# EasyEDA Pro project ProProject_阵列式磁场检测仪_2024-06-02.epro, board PCB2
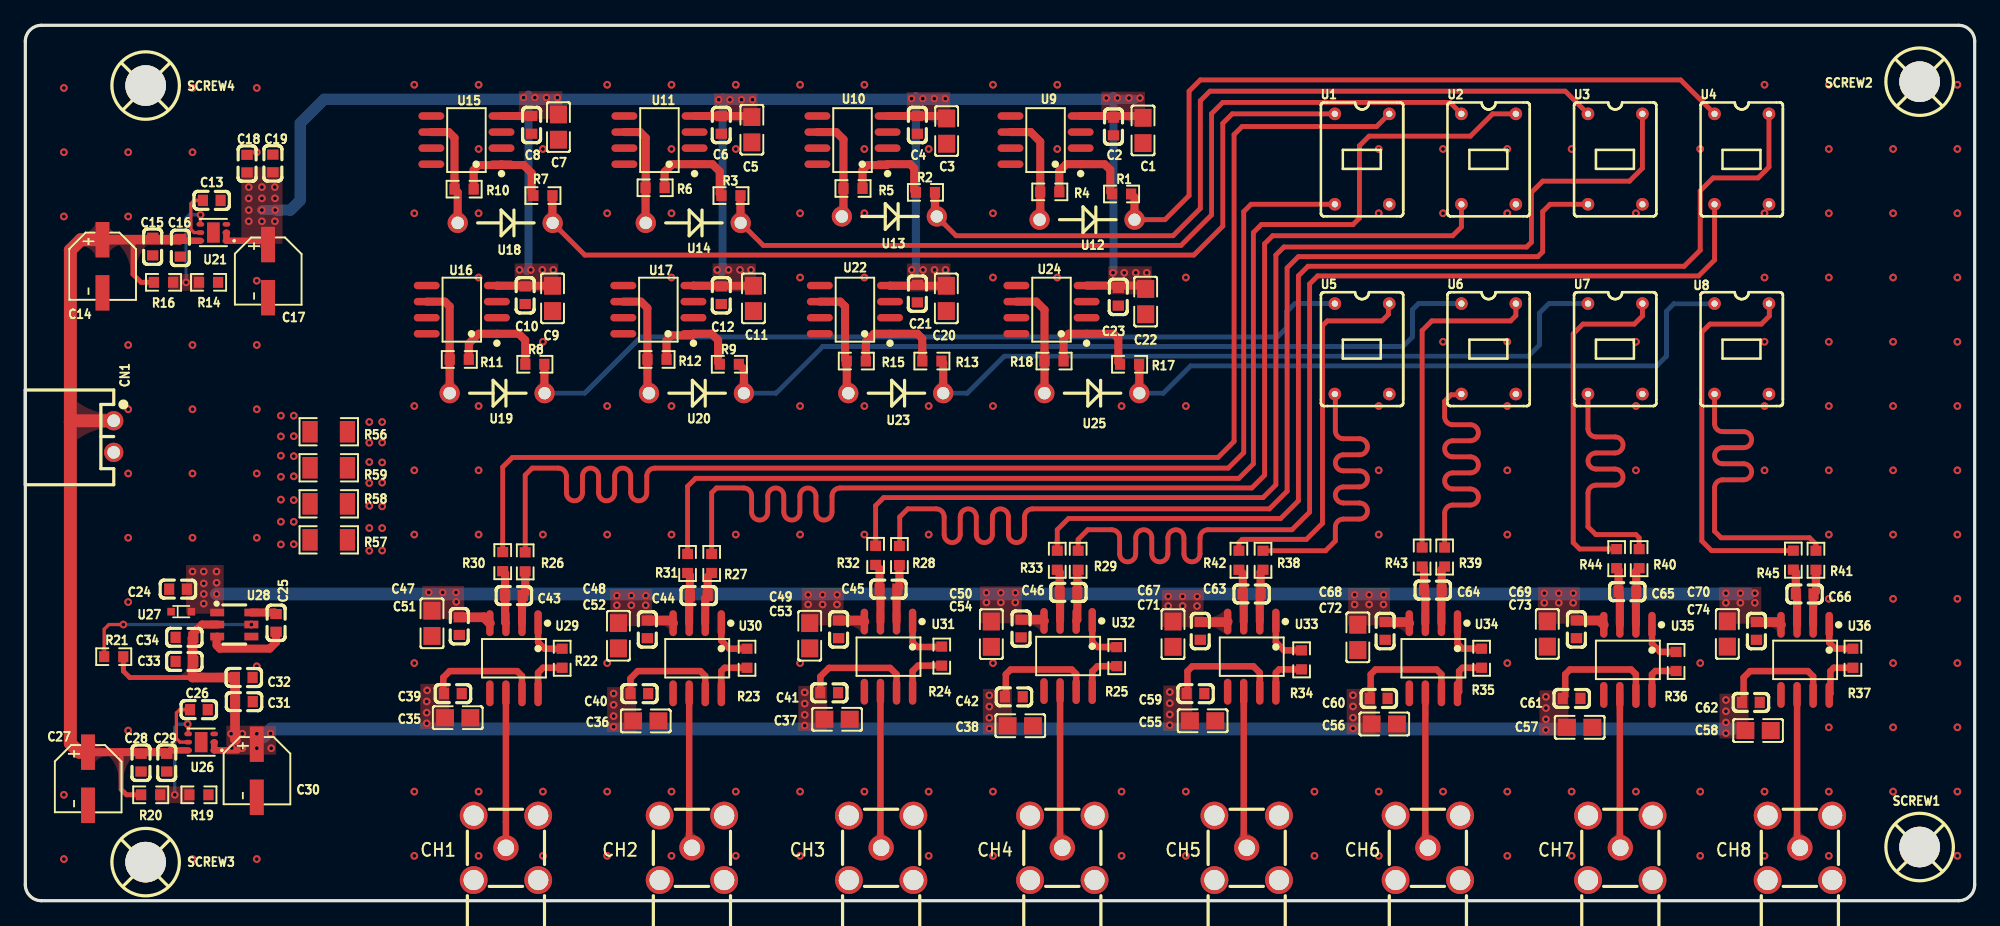
[diagram p4: board, top side]
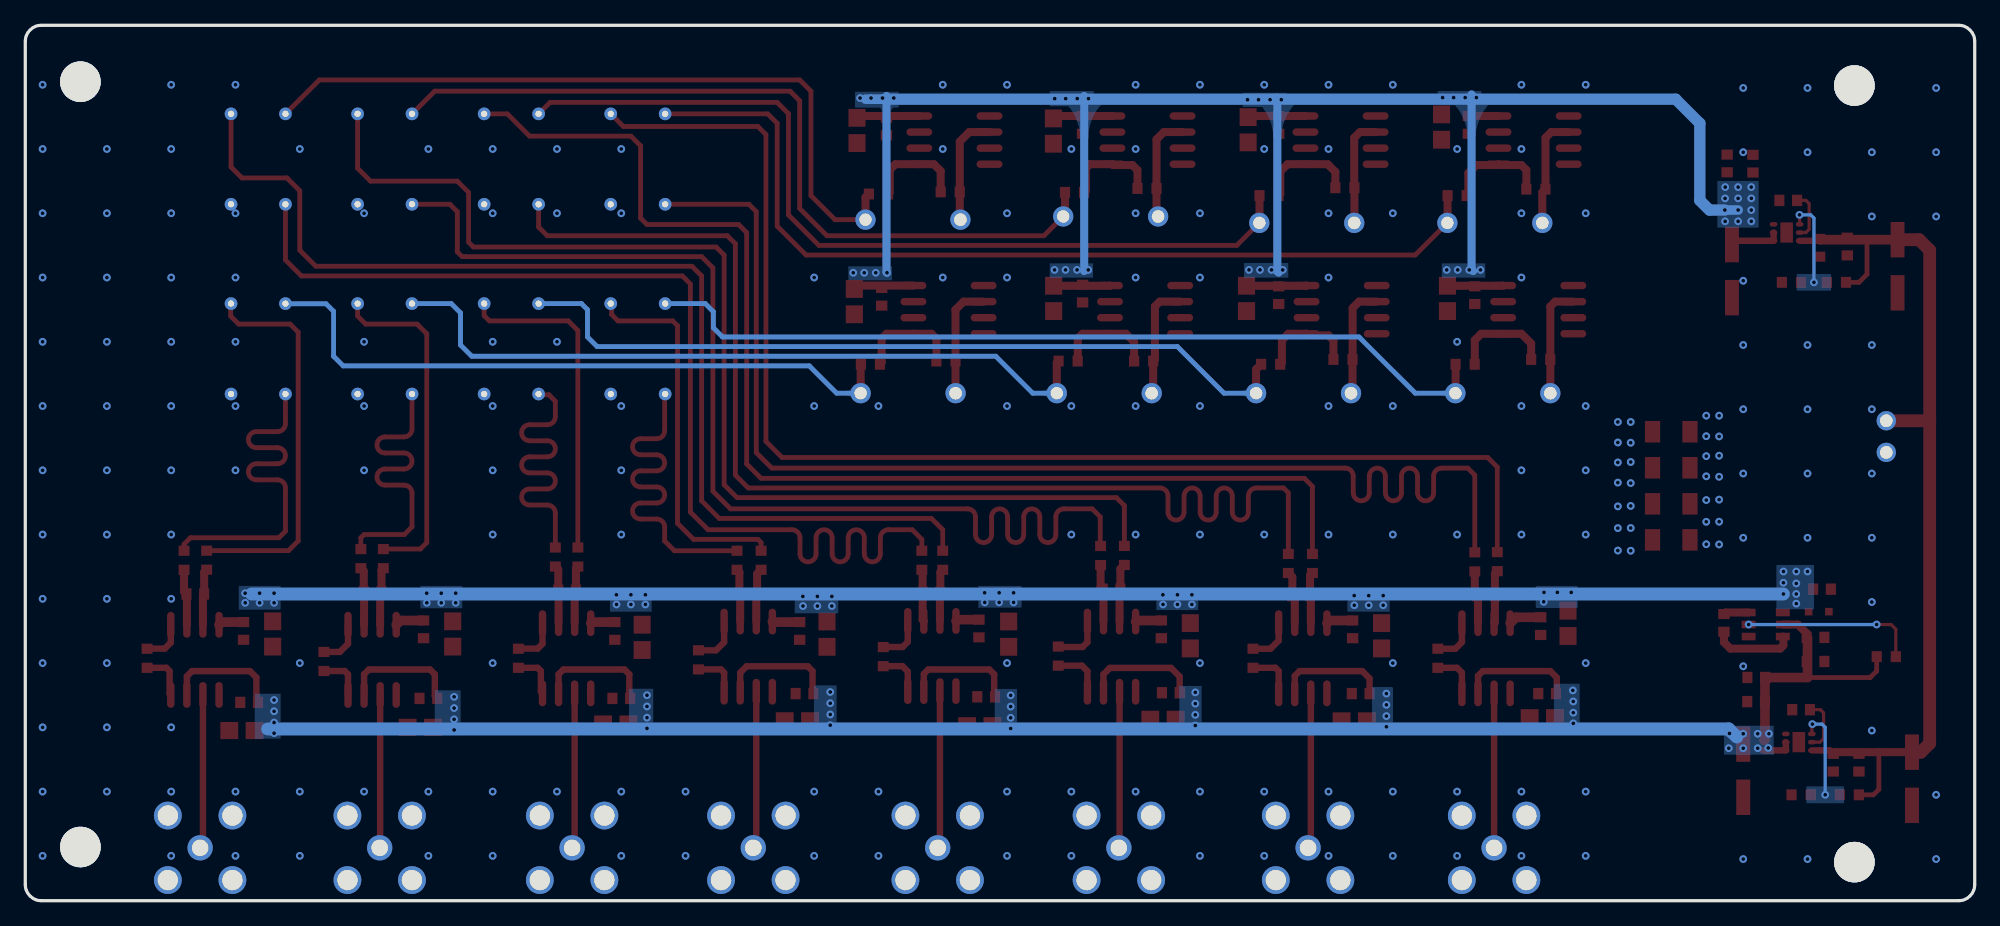
[diagram p5: board, bottom side, seen from below]

Outline 154.02 x 69.2 mm; copper layers: Top Layer, Bottom Layer. Coordinates in mm from the lower left corner of the outline.
Outline path: 0,67.93 0,1.27 arc(0.37,0.37) 1.27,0 152.75,0 arc(153.65,0.37) 154.02,1.27 154.02,67.93 arc(153.65,68.83) 152.75,69.2 1.27,69.2 arc(0.37,68.83) 0,67.93
Stack: Top Layer 0.035mm / Dielectric1 1.51mm FR4 er 4.5 / Bottom Layer 0.035mm

## Design rules (mm)
template: 自定义配置
spacing copperThickness1oz (default): track to track 0.102, other pairs 0.152 to 0.3
spacing copperThickness2oz: track to track 0.203, other pairs 0.152 to 0.3
track width copperThickness1oz (default): min 0.127, default 0.254, max 2.54
track width copperThickness2oz: min 0.203, default 0.254, max 2.54
differential pair differentialPair (default): width min 0.127, default 0.254, max 2.54; gap min 0.152, default 0.152
via viaSize (default): diameter min 0.5, default 0.61, max 10; hole min 0.3, default 0.305, max 6.3

## Placement (name value [footprint] x y rotation side)
C1  10uF  [C0805]  88.31 60.89 90 top
C2  100nF  [C0603]  85.98 61.2 90 top
C3  10uF  [C0805]  72.79 60.84 90 top
C4  100nF  [C0603]  70.48 61.33 90 top
C5  10uF  [C0805]  57.4 60.95 90 top
C6  100nF  [C0603]  54.99 61.33 90 top
C7  10uF  [C0805]  42.12 61.16 90 top
C8  100nF  [C0603]  40 61.33 90 top
C9  10uF  [C0805]  41.66 47.61 90 top
C10  100nF  [C0603]  39.5 47.87 90 top
C11  10uF  [C0805]  57.53 47.61 90 top
C12  100nF  [C0603]  54.99 47.87 90 top
C13  1nF  [C0603]  14.73 55.36 0 top
C14  10uF  [CAP-SMD_BD5.0-L5.3-W5.3-FD]  6.1 50.15 270 top
C15  2.2uF  [C0603]  10.06 51.71 90 top
C16  100nF  [C0603]  12.25 51.62 90 top
C17  10uF  [CAP-SMD_BD5.0-L5.3-W5.3-FD]  19.18 49.77 270 top
C18  2.2uF  [C0603]  17.52 58.27 270 top
C19  100nF  [C0603]  19.56 58.28 270 top
C20  10uF  [C0805]  72.77 47.61 90 top
C21  100nF  [C0603]  70.48 48 90 top
C22  10uF  [C0805]  88.52 47.36 90 top
C23  100nF  [C0603]  86.36 47.74 90 top
C24  3.3uF  [C0603]  12.06 24.63 0 top
C25  3.3uF  [C0603]  19.81 21.96 270 top
C26  1nF  [C0603]  13.72 15.1 0 top
C27  10uF  [CAP-SMD_BD5.0-L5.3-W5.3-FD]  4.95 9.64 270 top
C28  2.2uF  [C0603]  9.14 10.91 90 top
C29  100nF  [C0603]  11.18 10.91 90 top
C30  10uF  [CAP-SMD_BD5.0-L5.3-W5.3-FD]  18.29 10.28 270 top
C31  2.2uF  [C0603]  17.27 15.74 180 top
C32  100nF  [C0603]  17.26 17.65 180 top
C33  3.3uF  [C0603]  12.57 18.91 0 top
C34  100nF  [C0603]  12.57 20.82 0 top
C35  10uF  [C0805]  34.16 14.47 180 top
C36  10uF  [C0805]  49.02 14.21 180 top
C37  10uF  [C0805]  64.14 14.34 180 top
C38  10uF  [C0805]  78.61 13.83 180 top
C39  100nF  [C0603]  33.78 16.37 180 top
C40  100nF  [C0603]  48.51 16.37 180 top
C41  100nF  [C0603]  63.52 16.44 180 top
C42  100nF  [C0603]  78.11 16.12 180 top
C43  47nF  [C0603]  38.61 24.12 0 top
C44  47nF  [C0603]  53.21 24.12 0 top
C45  47nF  [C0603]  68.2 24.63 0 top
C46  47nF  [C0603]  82.42 24.37 0 top
C47  10uF  [C0805]  32.13 21.93 90 top
C48  10uF  [C0805]  46.86 20.94 90 top
C49  10uF  [C0805]  61.98 20.94 90 top
C50  10uF  [C0805]  76.33 21.07 90 top
C51  100nF  [C0603]  34.29 21.71 90 top
C52  100nF  [C0603]  49.15 21.45 90 top
C53  100nF  [C0603]  64.26 21.45 90 top
C54  100nF  [C0603]  78.67 21.52 90 top
C55  10uF  [C0805]  93.02 14.22 180 top
C56  10uF  [C0805]  107.37 13.97 180 top
C57  10uF  [C0805]  122.81 13.71 180 top
C58  10uF  [C0805]  136.91 13.45 180 top
C59  100nF  [C0603]  92.46 16.37 180 top
C60  100nF  [C0603]  106.93 15.99 180 top
C61  100nF  [C0603]  122.17 15.99 180 top
C62  100nF  [C0603]  136.34 15.68 180 top
C63  47nF  [C0603]  96.9 24.25 0 top
C64  47nF  [C0603]  111.21 24.55 0 top
C65  47nF  [C0603]  126.58 24.42 0 top
C66  47nF  [C0603]  140.59 24.25 0 top
C67  10uF  [C0805]  90.68 21.07 90 top
C68  10uF  [C0805]  105.28 20.82 90 top
C69  10uF  [C0805]  120.25 21.09 90 top
C70  10uF  [C0805]  134.48 21.09 90 top
C71  100nF  [C0603]  92.84 21.33 90 top
C72  100nF  [C0603]  107.44 21.33 90 top
C73  100nF  [C0603]  122.55 21.45 90 top
C74  100nF  [C0603]  136.78 21.33 90 top
CH1  BWSMA-KWE-Z001  [SMA-TH_BWSMA-KWE-Z001]  37.97 4.18 270 top
CH2  BWSMA-KWE-Z001  [SMA-TH_BWSMA-KWE-Z001]  52.67 4.18 270 top
CH3  BWSMA-KWE-Z001  [SMA-TH_BWSMA-KWE-Z001]  67.62 4.18 270 top
CH4  BWSMA-KWE-Z001  [SMA-TH_BWSMA-KWE-Z001]  81.93 4.18 270 top
CH5  BWSMA-KWE-Z001  [SMA-TH_BWSMA-KWE-Z001]  96.5 4.18 270 top
CH6  BWSMA-KWE-Z001  [SMA-TH_BWSMA-KWE-Z001]  110.82 4.18 270 top
CH7  BWSMA-KWE-Z001  [SMA-TH_BWSMA-KWE-Z001]  126.02 4.18 270 top
CH8  BWSMA-KWE-Z001  [SMA-TH_BWSMA-KWE-Z001]  140.21 4.18 270 top
CN1  XH2.54-2P_H弯针插座  [CONN-TH_2P-P2.5_XH2.54-2P_H]  6.98 36.69 270 top
R1  1.4kΩ  [R0603]  86.61 55.87 0 top
R2  1.4kΩ  [R0603]  71.12 56 0 top
R3  1.4kΩ  [R0603]  55.75 55.74 0 top
R4  140Ω  [R0603]  80.94 56.03 180 top
R5  140Ω  [R0603]  65.4 56.3 180 top
R6  140Ω  [R0603]  49.76 56.36 180 top
R7  1.4kΩ  [R0603]  40.89 55.74 0 top
R8  1.4kΩ  [R0603]  40.26 42.41 0 top
R9  1.4kΩ  [R0603]  55.63 42.41 0 top
R10  140Ω  [R0603]  34.67 56.25 180 top
R11  140Ω  [R0603]  34.29 42.79 180 top
R12  140Ω  [R0603]  49.91 42.79 180 top
R13  1.4kΩ  [R0603]  71.63 42.66 0 top
R14  24kΩ  [R0603]  14.48 48.88 0 top
R15  140Ω  [R0603]  65.66 42.66 180 top
R16  150kΩ  [R0603]  10.92 48.88 0 top
R17  1.4kΩ  [R0603]  87.25 42.41 0 top
R18  140Ω  [R0603]  81.28 42.66 180 top
R19  24kΩ  [R0603]  13.72 8.37 0 top
R20  150kΩ  [R0603]  9.91 8.37 0 top
R21  10K  [R0603]  6.98 19.29 0 top
R22  499Ω  [R0603]  42.42 19.17 90 top
R23  499Ω  [R0603]  57.02 19.17 90 top
R24  499Ω  [R0603]  72.41 19.33 90 top
R25  499Ω  [R0603]  86.23 19.29 90 top
R26  1kΩ  [R0603]  39.5 26.79 90 top
R27  1kΩ  [R0603]  54.23 26.66 90 top
R28  1kΩ  [R0603]  69.06 27.29 90 top
R29  1kΩ  [R0603]  83.18 26.91 90 top
R30  1kΩ  [R0603]  37.72 26.8 90 top
R31  1kΩ  [R0603]  52.32 26.66 90 top
R32  1kΩ  [R0603]  67.18 27.29 90 top
R33  1kΩ  [R0603]  81.53 26.91 90 top
R34  499Ω  [R0603]  100.84 19.04 90 top
R35  499Ω  [R0603]  115.06 19.17 90 top
R36  499Ω  [R0603]  130.43 18.91 90 top
R37  499Ω  [R0603]  144.4 19.17 90 top
R38  1kΩ  [R0603]  97.79 26.91 90 top
R39  1kΩ  [R0603]  112.14 27.17 90 top
R40  1kΩ  [R0603]  127.51 27.04 90 top
R41  1kΩ  [R0603]  141.48 26.91 90 top
R42  1kΩ  [R0603]  95.89 26.91 90 top
R43  1kΩ  [R0603]  110.36 27.17 90 top
R44  1kΩ  [R0603]  125.73 27.04 90 top
R45  1kΩ  [R0603]  139.69 26.92 90 top
R56  0Ω  [R1206]  23.97 37.07 0 top
R57  0Ω  [R1206]  23.97 28.53 0 top
R58  0Ω  [R1206]  23.97 31.38 0 top
R59  0Ω  [R1206]  23.97 34.22 0 top
SCREW1  -  [M3螺丝]  149.73 4.18 0 top
SCREW2  -  [M3螺丝]  149.73 64.68 0 top
SCREW3  -  [M3螺丝]  9.57 2.99 0 top
SCREW4  -  [M3螺丝]  9.57 64.38 0 top
U1  -  [HALL]  102.36 63.11 0 top
U2  -  [HALL]  112.36 63.11 0 top
U3  -  [HALL]  122.36 63.11 0 top
U4  -  [HALL]  132.36 63.11 0 top
U5  -  [HALL]  102.36 48.11 0 top
U6  -  [HALL]  112.36 48.11 0 top
U7  -  [HALL]  122.36 48.11 0 top
U8  -  [HALL]  132.36 48.11 0 top
U9  LM234DT  [SOIC-8_L4.9-W3.9-P1.27-LS6.0-BL]  80.61 60.13 90 top
U10  LM234DT  [SOIC-8_L4.9-W3.9-P1.27-LS6.0-BL]  65.36 60.13 90 top
U11  LM234DT  [SOIC-8_L4.9-W3.9-P1.27-LS6.0-BL]  50.11 60.13 90 top
U12  -  [IN457]  80.14 53.84 0 top
U13  -  [IN457]  64.52 54.09 0 top
U14  -  [IN457]  49.02 53.58 0 top
U15  LM234DT  [SOIC-8_L4.9-W3.9-P1.27-LS6.0-BL]  34.85 60.13 90 top
U16  LM234DT  [SOIC-8_L4.9-W3.9-P1.27-LS6.0-BL]  34.49 46.72 90 top
U17  LM234DT  [SOIC-8_L4.9-W3.9-P1.27-LS6.0-BL]  50.02 46.72 90 top
U18  -  [IN457]  34.16 53.58 0 top
U19  -  [IN457]  33.53 40.12 0 top
U20  -  [IN457]  49.28 40.12 0 top
U21  SGM2211-5.0XTDI6G/TR  [TDFN-6_L2.0-W2.0-P0.65-BL-EP]  14.86 52.82 90 top
U22  LM234DT  [SOIC-8_L4.9-W3.9-P1.27-LS6.0-BL]  65.55 46.72 90 top
U23  -  [IN457]  65.02 40.12 0 top
U24  LM234DT  [SOIC-8_L4.9-W3.9-P1.27-LS6.0-BL]  81.08 46.72 90 top
U25  -  [IN457]  80.52 40.12 0 top
U26  SGM2211-5.0XTDI6G/TR  [TDFN-6_L2.0-W2.0-P0.65-BL-EP]  13.89 12.53 90 top
U27  IN4148WT  [SOD-523_L1.2-W0.8-LS1.6-FD]  12.32 22.85 180 top
U28  SGM3204YN6G/TR  [SOT-23-6_L2.9-W1.6-P0.95-LS2.8-BR]  16.51 21.83 180 top
U29  INA101ASOIC8  [SOIC-8_L4.9-W3.9-P1.27-LS6.0-BL]  38.61 19.17 180 top
U30  INA101ASOIC8  [SOIC-8_L4.9-W3.9-P1.27-LS6.0-BL]  53.09 19.17 180 top
U31  INA101ASOIC8  [SOIC-8_L4.9-W3.9-P1.27-LS6.0-BL]  68.2 19.29 180 top
U32  INA101ASOIC8  [SOIC-8_L4.9-W3.9-P1.27-LS6.0-BL]  82.39 19.34 180 top
U33  INA101ASOIC8  [SOIC-8_L4.9-W3.9-P1.27-LS6.0-BL]  96.9 19.29 180 top
U34  INA101ASOIC8  [SOIC-8_L4.9-W3.9-P1.27-LS6.0-BL]  111.25 19.17 180 top
U35  INA101ASOIC8  [SOIC-8_L4.9-W3.9-P1.27-LS6.0-BL]  126.62 19.04 180 top
U36  INA101ASOIC8  [SOIC-8_L4.9-W3.9-P1.27-LS6.0-BL]  140.62 19.04 180 top

## Footprints (pads in the part's own frame, mm; a bottom-side part is the same pattern mirrored in y, then rotated)
C0603
  rect 0.8x0.9 smd: 1(-0.7,0) 2(0.7,0)
C0805
  rect 1.41x1.35 smd: 1(-1,0) 2(1,0)
CAP-SMD_BD5.0-L5.3-W5.3-FD
  rect 2.8x1.1 smd: 1(-2.1,0) 2(2.1,0)
CONN-TH_2P-P2.5_XH2.54-2P_H
  round 1.524 hole 1: 1(-1.25,0) 2(1.25,0)
HALL
  round 1 hole 0.5: 1(1.104,-0.904) 2(1.104,-8.053) 3(5.404,-8.053) 4(5.404,-0.904)
IN457
  round 1.6 hole 0.99x0.97: 1(0,0)
  round 1.6 hole 0.97: 2(7.5,0)
M3螺丝
  round 3.2 hole 3.2: 1(-0.064,0.064)
R0603
  rect 0.806x0.864 smd: 1(-0.753,0) 2(0.753,0)
R1206
  rect 1.208x1.701 smd: 1(-1.479,0) 2(1.479,0)
SMA-TH_BWSMA-KWE-Z001
  round 2.2 hole 1.6: 1(-2.55,-2.55) 2(-2.55,2.55) 3(2.55,2.55) 4(2.55,-2.55)
  round 2 hole 1.3: 5(0,0)
SOD-523_L1.2-W0.8-LS1.6-FD
  rect 0.6x0.6 smd: 1(-0.8,0) 2(0.8,0)
SOIC-8_L4.9-W3.9-P1.27-LS6.0-BL
  oval 0.588x2.045 smd: 1(-1.905,-2.772) 2(-0.635,-2.772) 3(0.635,-2.772) 4(1.905,-2.772) 5(1.905,2.772) 6(0.635,2.772) 7(-0.635,2.772) 8(-1.905,2.772)
SOT-23-6_L2.9-W1.6-P0.95-LS2.8-BR
  rect 1.1x0.6 smd: 1(1.35,-0.95) 2(1.35,0) 3(1.35,0.95) 4(-1.35,0.95) 5(-1.35,0) 6(-1.35,-0.95)
TDFN-6_L2.0-W2.0-P0.65-BL-EP
  oval 0.364x0.607 smd: 1(-0.65,-1.028) 2(0,-1.028) 3(0.65,-1.028) 4(0.65,1.028) 5(0,1.028) 6(-0.65,1.028)
  rect 1.6x1 smd: 7(0,0)

## Nets
As in the schematic.

Pads without a net: SCREW1 1; SCREW2 1; SCREW3 1; SCREW4 1; U9 2 3 5 7 8; U10 2 3 5 7 8; U11 2 3 5 7 8; U15 2 3 5 7 8; U16 2 3 5 7 8; U17 2 3 5 7 8; U22 2 3 5 7 8; U24 2 3 5 7 8

## Via types
v1: diameter 0.61, hole 0.304, Top Layer to Bottom Layer, 157 vias
v2: diameter 0.61, hole 0.305, Top Layer to Bottom Layer, 201 vias

## Routing (per net, layer and track width the routed paths; a pad name or vN(x,y) marks a point on that pad's centre or on a via; arc(x,y) is an arc through that point)
5V: length 213.5
  Top Layer w0.381: 13.21,17.64 8.25,17.64 7.75,18.15 7.75,19.28 R21.2
  Top Layer w0.508: U33.7 97.54,18.02 97.03,18.53 92.2,18.53 91.82,18.15 91.82,16.44 C59.2 ; 16.76,11.88 U26.1 U26.2 ; 47.81,16.37 47.81,17.58 48.39,18.15 53.34,18.15 53.72,17.77 U30.7 ; C61.2 121.67,16.18 121.67,17.9 122.05,18.28 126.87,18.28 127.25,17.9 U35.7 ; U36.7 141.26,17.74 140.84,18.15 136.27,18.15 135.76,17.64 135.76,15.8 C62.2 ; C42.2 77.47,16.18 77.47,17.9 77.85,18.28 82.68,18.28 83.03,17.93 U32.7 ; U29.7 39.24,17.77 38.86,18.15 33.53,18.15 33.02,17.64 33.02,16.43 C39.2 ; C60.2 106.3,16.06 106.3,17.9 106.68,18.28 111.51,18.28 111.89,17.9 U34.7 ; 62.82,16.44 62.82,17.72 63.5,18.4 68.33,18.4 68.83,17.9 U31.7
  Top Layer w0.635: C34.2 13.27,21.14 13.97,21.83 15.16,21.83
  Top Layer w0.762: 16.38,17.52 16.26,17.64 13.21,17.64 13.21,20.75 C34.2 ; 16.64,12.69 16.57,12.75 C31.2 16.57,17.63 C32.2
  Bottom Layer w1.016: 18.8,12.94 19.43,13.58 134.87,13.58
  vias: v2(16.26,13.2) v2(16.31,12.07) v2(17.14,13.2) v2(17.14,12.05) v2(18.29,13.2) v2(18.29,12.05) v2(19.38,13.22) v2(19.43,12.05) v2(31.75,16.63) v2(31.72,15.75) v2(31.72,14.86) v2(31.72,14.02) v2(46.48,16.37) v2(46.48,15.48) v2(46.48,14.59) v2(46.48,13.75) v2(61.58,16.47) v2(61.58,15.58) v2(61.58,14.69) v2(61.58,13.85) v2(76.17,16.23) v2(76.17,15.35) v2(76.17,14.46) v2(76.17,13.61) v2(90.42,16.5) v2(90.42,15.61) v2(90.42,14.72) v2(90.42,13.88) v2(104.9,16.25) v2(104.9,15.36) v2(104.9,14.47) v2(104.9,13.62) v2(120.14,16.12) v2(120.14,15.23) v2(120.14,14.34) v2(120.14,13.5) v2(134.37,15.86) v2(134.37,14.98) v2(134.37,14.09) v2(134.37,13.24)
9V: length 72
  Top Layer w0.381: 8.51,51.93 8.51,49.52 9.14,48.88 R16.1 ; R20.1 8,8.37 7.57,8.8 7.57,11.74
  Top Layer w0.508: C16.2 12.4,52.17 U21.6 ; U26.6 11.45,11.88 C29.2
  Top Layer w0.635: C29.2 11.05,11.74 C27.1
  Top Layer w0.762: C16.2 12.19,52.25 C14.1
  Top Layer w1.016: 3.56,37.84 3.66,37.94 CN1.1 ; 3.56,37.84 3.56,51.42 4.39,52.25 C14.1 ; 3.56,37.84 3.56,12.44 4.25,11.74 C27.1
-5V: length 138.1
  Top Layer w0.762: C54.2 80.39,22.22 U32.4 ; U34.4 109.26,22.03 C72.2 ; C53.2 66.21,22.15 U31.4 ; C51.2 36.24,22.41 U29.4 ; U35.4 124.37,22.15 C73.2 ; U33.4 94.96,22.03 C71.2 ; C52.2 50.97,22.15 U30.4 ; C74.2 138.5,22.03 U36.4
  Bottom Layer w1.016: v2(15.11,24.25) 136.14,24.25
  vias: v2(13.21,26.02) v2(14.1,26.02) v2(14.1,25.08) v2(14.1,24.25) v2(14.1,23.48) v2(15.11,26.02) v2(15.11,25.14) v2(31.88,24.37) v2(32.98,24.37) v2(34.03,24.37) v2(34.05,23.62) v2(46.74,24.12) v2(46.74,23.36) v2(47.88,24.12) v2(47.88,23.36) v2(49.03,24.12) v2(49.02,23.36) v2(61.85,24.18) v2(61.85,23.42) v2(62.99,24.18) v2(62.99,23.42) v2(64.14,24.18) v2(64.13,23.42) v2(75.93,24.34) v2(75.93,23.58) v2(77.08,24.34) v2(77.08,23.58) v2(78.23,24.34) v2(78.22,23.58) v2(90.3,24.06) v2(90.3,23.29) v2(91.44,24.06) v2(91.44,23.29) v2(92.59,24.06) v2(92.58,23.29) v2(105.03,24.18) v2(105.03,23.42) v2(106.17,24.18) v2(106.17,23.42) v2(107.32,24.18) v2(107.31,23.42) v2(120.02,24.31) v2(120.02,23.55) v2(121.16,24.31) v2(121.16,23.55) v2(122.31,24.31) v2(122.3,23.55) v2(134.37,24.31) v2(134.37,23.55) v2(135.51,24.31) v2(135.51,23.55) v2(136.66,24.31) v2(136.65,23.55)
AGND:
  vias: v1(30.73,64.51) v1(30.73,54.35) v1(30.73,39.11) v1(30.73,34.03) v1(30.73,28.95) v1(30.73,18.79) v1(30.73,8.63) v1(30.73,3.55) v1(35.81,64.51) v1(35.81,59.43) v1(35.81,54.35) v1(35.81,49.27) v1(35.81,39.11) v1(35.81,34.03) v1(35.81,28.95) v1(35.81,8.63) v1(35.81,3.55) v1(40.89,59.43) v1(40.89,44.19) v1(40.89,28.95) v1(40.89,8.63) v1(40.89,3.55) v1(45.97,64.51) v1(45.97,54.35) v1(45.97,39.11) v1(45.97,28.95) v1(45.97,18.79) v1(45.97,8.63) v1(45.97,3.55) v1(51.05,64.51) v1(51.05,59.43) v1(51.05,54.35) v1(51.05,49.27) v1(51.05,39.11) v1(51.05,28.95) v1(51.05,8.63) v1(51.05,3.55) v1(56.13,64.51) v1(56.13,59.43) v1(56.13,28.95) v1(56.13,8.63) v1(56.13,3.55) v1(61.21,64.51) v1(61.21,54.35) v1(61.21,49.27) v1(61.21,39.11) v1(61.21,28.95) v1(61.21,18.79) v1(61.21,8.63) v1(61.21,3.55) v1(66.29,64.51) v1(66.29,59.43) v1(66.29,54.35) v1(66.29,49.27) v1(66.29,39.11) v1(66.29,28.95) v1(66.29,8.63) v1(71.37,59.43) v1(71.37,39.11) v1(71.37,28.95) v1(71.37,8.63) v1(71.37,3.55) v1(76.45,64.51) v1(76.45,54.35) v1(76.45,49.27) v1(76.45,39.11) v1(76.45,18.79) v1(76.45,8.63) v1(76.45,3.55) v1(81.53,64.51) v1(81.53,59.43) v1(81.53,49.27) v1(86.61,39.11) v1(86.61,8.63) v1(86.61,3.55) v1(91.69,49.27) v1(91.69,39.11) v1(91.69,8.63) v1(91.69,3.55) v1(101.85,8.63) v1(101.85,3.55) v1(106.93,59.43) v1(106.93,54.35) v1(106.93,39.11) v1(106.93,34.03) v1(106.93,28.95) v1(106.93,8.63) v1(106.93,3.55) v1(112.01,59.43) v1(112.01,54.35) v1(112.01,44.19) v1(112.01,8.63) v1(117.09,59.43) v1(117.09,54.35) v1(117.09,44.19) v1(117.09,39.11) v1(117.09,34.03) v1(117.09,28.95) v1(117.09,18.79) v1(117.09,8.63) v1(117.09,3.55) v1(122.17,59.43) v1(122.17,8.63) v1(122.17,3.55) v1(127.25,54.35) v1(127.25,44.19) v1(127.25,39.11) v1(127.25,34.03) v1(127.25,8.63) v1(132.33,59.43) v1(132.33,18.79) v1(132.33,8.63) v1(132.33,3.55) v1(137.41,64.51) v1(137.41,54.35) v1(137.41,49.27) v1(137.41,44.19) v1(137.41,39.11) v1(137.41,34.03) v1(137.41,8.63) v1(137.41,3.55) v1(142.49,64.51) v1(142.49,59.43) v1(142.49,54.35) v1(142.49,49.27) v1(142.49,44.19) v1(142.49,39.11) v1(142.49,34.03) v1(142.49,28.95) v1(142.49,23.87) v1(142.49,13.71) v1(142.49,8.63) v1(142.49,3.55) v1(147.57,59.43) v1(147.57,54.35) v1(147.57,49.27) v1(147.57,44.19) v1(147.57,39.11) v1(147.57,34.03) v1(147.57,28.95) v1(147.57,23.87) v1(147.57,18.79) v1(147.57,13.71) v1(147.57,8.63) v1(152.65,64.51) v1(152.65,59.43) v1(152.65,54.35) v1(152.65,49.27) v1(152.65,44.19) v1(152.65,39.11) v1(152.65,34.03) v1(152.65,28.95) v1(152.65,23.87) v1(152.65,18.79) v1(152.65,13.71) v1(152.65,8.63) v1(152.65,3.55) v2(27.18,37.85) v2(27.18,36.21) v2(27.18,34.68) v2(27.18,33.02) v2(27.18,31.21) v2(27.18,29.46) v2(27.18,27.67) v2(28.19,37.85) v2(28.19,36.22) v2(28.19,34.65) v2(28.19,33.05) v2(28.19,31.17) v2(28.19,29.45) v2(28.19,27.68)
PGND:
  vias: v2(3.05,64.25) v2(3.05,59.17) v2(3.05,54.09) v2(3.05,8.37) v2(3.05,3.29) v2(8.13,59.17) v2(8.13,54.09) v2(8.13,43.93) v2(8.13,38.85) v2(8.13,33.77) v2(8.13,28.69) v2(8.13,23.61) v2(8.13,13.45) v2(13.21,64.25) v2(13.21,59.17) v2(13.21,43.93) v2(13.21,38.85) v2(13.21,33.77) v2(13.21,28.69) v2(13.21,3.29) v2(18.29,64.25) v2(18.29,59.17) v2(18.29,49.01) v2(18.29,43.93) v2(18.29,38.85) v2(18.29,33.77) v2(18.29,28.69) v2(18.29,18.53) v2(18.29,3.29) v2(20.19,38.34) v2(20.19,36.7) v2(20.19,35.18) v2(20.19,33.51) v2(20.19,31.71) v2(20.19,29.96) v2(20.19,28.16) v2(21.21,38.34) v2(21.21,36.72) v2(21.21,35.14) v2(21.21,33.55) v2(21.21,31.67) v2(21.21,29.95) v2(21.21,28.18)
VCC234: length 170.9
  Top Layer w0.508: C17.1 18.88,52.17 U21.1 U21.2
  Top Layer w0.635: C22.2 88.25,48.63 U24.4 ; U15.4 40,62.03 C8.2 ; C11.2 52.8,48.61 U17.4 ; U11.4 57.32,62.03 ; C1.2 88.17,62.03 U9.4 ; C3.2 72.6,62.03 U10.4 ; U16.4 37.27,48.61 C9.2 ; U22.4 68.33,48.61 C20.2
  Top Layer w1.016: 57.32,62.03 C5.2
  Bottom Layer w0.635: 70.36,63.62 70.36,49.77 ; 54.99,49.65 55.1,49.75 55.1,63.36 ; 85.98,63.62 85.98,49.68 v2(85.94,49.64) ; 39.62,49.77 39.75,49.9 39.75,63.74
  Bottom Layer w0.762: v2(18.69,54.6) v2(19.74,54.6) ; 85.98,63.36 87.63,63.36
  Bottom Layer w0.889: 85.98,63.36 23.62,63.36 21.72,61.46 21.72,55.36 20.95,54.6 v2(19.74,54.6)
  vias: v2(17.66,56.41) v2(17.65,55.52) v2(17.65,54.6) v2(17.65,53.71) v2(18.69,56.41) v2(18.69,55.52) v2(18.69,53.71) v2(19.71,56.41) v2(19.72,55.52) v2(19.72,53.71) v2(39.05,49.87) v2(39.37,63.49) v2(39.94,49.87) v2(40.26,63.49) v2(40.85,49.87) v2(41.17,63.49) v2(41.71,49.87) v2(42.04,63.49) v2(54.67,49.87) v2(54.78,63.32) v2(55.56,49.87) v2(55.67,63.32) v2(56.47,49.87) v2(56.58,63.32) v2(57.34,49.87) v2(57.45,63.32) v2(70.02,63.41) v2(70.04,49.87) v2(70.91,63.41) v2(70.92,49.87) v2(71.82,63.41) v2(71.83,49.87) v2(72.69,63.41) v2(72.7,49.87) v2(85.4,63.46) v2(86.29,63.46) v2(86.83,49.64) v2(87.2,63.46) v2(87.74,49.64) v2(88.07,63.46) v2(88.61,49.64)
CH1: length 11.6
  Top Layer w0.508: 37.97,5.2 37.97,16.77
CH2: length 12.4
  Top Layer w0.508: CH2.5 52.45,4.4 52.45,16.52
CH3: length 12.4
  Top Layer w0.508: CH3.5 67.56,4.23 U31.6
CH4: length 12.6
  Top Layer w0.508: 81.76,16.7 81.76,4.36 CH4.5
CH5: length 12.6
  Top Layer w0.508: CH5.5 96.27,4.42 96.27,16.65
CH6: length 12.3
  Top Layer w0.508: CH6.5 110.62,4.38 U34.6
CH7: length 12.2
  Top Layer w0.508: CH7.5 125.98,4.22 125.98,16.39
CH8: length 12.3
  Top Layer w0.508: 139.99,16.39 139.99,4.4 CH8.5
IN1+: length 74.4
  Top Layer w0.381: U1.1 95.36,62.2 94.61,61.46 94.61,53.33 92.33,51.04 44.2,51.04 U18.2
  Top Layer w0.635: U18.2 41.65,53.6 R7.2
IN2+: length 69.6
  Top Layer w0.381: U2.1 112.56,63.11 94.61,63.11 93.73,62.22 93.73,54.22 91.31,51.81 58.3,51.81 U14.2
  Top Layer w0.635: U14.2 56.51,53.6 R3.2
IN3+: length 64.5
  Top Layer w0.381: U3.1 121.67,64 93.6,64 92.84,63.24 92.84,54.73 90.68,52.57 73.54,52.57 U13.2
  Top Layer w0.635: U13.2 71.87,54.23 R2.2
IN4+: length 58.5
  Top Layer w0.381: U4.1 130.78,64.89 92.84,64.89 91.95,64 91.95,55.74 90.04,53.84 U12.2
  Top Layer w0.635: R1.2 87.64,55.6 U12.2
IN5+: length 68.4
  Top Layer w0.635: R8.2 41.01,40.14 U19.2
  Bottom Layer w0.381: U5.1 100.3,47.2 99.66,46.56 99.66,45.29 98.93,44.57 48.64,44.57 44.2,40.12 U19.2
IN6+: length 63.3
  Top Layer w0.635: U20.2 56.78,42.01 R9.2
  Bottom Layer w0.381: U6.1 110.08,47.2 109.6,46.73 109.6,44.57 108.84,43.8 62.99,43.8 59.31,40.12 U20.2
IN7+: length 58
  Top Layer w0.635: U23.2 72.52,42.52 R13.2
  Bottom Layer w0.381: U7.1 120.37,47.2 119.63,46.47 119.63,43.93 118.74,43.04 77.34,43.04 74.42,40.12 U23.2
IN8+: length 52.8
  Top Layer w0.635: U25.2 88.02,42.39 R17.2
  Bottom Layer w0.381: U8.1 133.46,47.19 130.26,47.19 129.67,46.6 129.67,43.04 128.9,42.28 92.08,42.28 89.92,40.12 U25.2
O1+: length 102.5
  Top Layer w0.381: U1.4 106.77,61.2 96.14,61.2 95.5,60.57 95.5,36.31 94.23,35.04 38.48,35.04 37.72,34.28 37.72,27.56
O1-: length 102.3
  Top Layer w0.381: U1.2 96.85,55.05 96.27,54.47 96.27,35.42 95.04,34.2 49.74,34.2 arc(49.29,34.01) 49.1,33.56 49.1,32.25 arc(48.47,31.61) 47.83,32.25 47.83,33.56 arc(47.2,34.2) 46.56,33.56 46.56,32.25 arc(45.93,31.61) 45.29,32.25 45.29,33.56 arc(44.66,34.2) 44.02,33.56 44.02,32.25 arc(43.39,31.61) 42.75,32.25 42.75,33.56 arc(42.57,34.01) 42.12,34.2 40.05,34.2 39.5,33.64 R26.2
O2+: length 97
  Top Layer w0.381: U2.4 115.94,62.2 114.17,60.44 106.17,60.44 105.41,59.68 105.41,53.96 104.9,53.46 97.66,53.46 97.03,52.82 97.03,34.53 95.89,33.39 52.96,33.39 52.32,32.76 R31.2
O2-: length 97.3
  Top Layer w0.381: R27.2 54.23,32.25 54.61,32.63 56.75,32.63 arc(57.2,32.44) 57.39,31.99 57.39,30.72 arc(58.02,30.09) 58.66,30.72 58.66,31.99 arc(59.29,32.63) 59.93,31.99 59.93,30.72 arc(60.56,30.09) 61.2,30.72 61.2,31.99 arc(61.83,32.63) 62.47,31.99 62.47,30.72 arc(63.1,30.09) 63.74,30.72 63.74,31.99 arc(63.92,32.44) 64.37,32.63 96.9,32.63 97.92,33.64 97.92,51.93 98.55,52.57 112.78,52.57 113.47,53.26 U2.2
O3+: length 92.1
  Top Layer w0.381: U3.4 127.77,57.91 126.75,56.89 119.89,56.89 119,56 119,52.06 118.62,51.68 99.44,51.68 98.81,51.04 98.81,32.88 97.79,31.87 67.82,31.87 67.18,31.23 R32.2
O3-: length 91.9
  Top Layer w0.381: 69.06,28.04 69.09,28.06 69.09,30.34 69.72,30.98 71.96,30.98 arc(72.41,30.79) 72.6,30.34 72.6,28.95 arc(73.23,28.31) 73.87,28.95 73.87,30.34 arc(74.5,30.98) 75.14,30.34 75.14,28.95 arc(75.77,28.31) 76.41,28.95 76.41,30.34 arc(77.04,30.98) 77.68,30.34 77.68,28.95 arc(78.31,28.31) 78.95,28.95 78.95,30.34 arc(79.13,30.79) 79.58,30.98 98.3,30.98 99.7,32.37 99.7,50.03 100.58,50.92 119.51,50.92 119.89,51.3 119.89,54.47 120.47,55.05 U3.2
O4+: length 87.1
  Top Layer w0.381: U4.4 137.77,58 136.91,57.14 133.35,57.14 132.33,56.12 132.33,51.42 131.06,50.15 101.35,50.15 100.58,49.39 100.58,31.61 99.19,30.22 82.42,30.22 81.53,29.33 R33.2
O4-: length 87.3
  Top Layer w0.381: R29.2 83.18,28.56 83.95,29.33 85.83,29.33 arc(86.28,29.14) 86.46,28.69 86.46,27.42 arc(87.1,26.79) 87.73,27.42 87.73,28.69 arc(88.37,29.33) 89,28.69 89,27.42 arc(89.64,26.79) 90.27,27.42 90.27,28.69 arc(90.91,29.33) 91.54,28.69 91.54,27.42 arc(92.18,26.79) 92.81,27.42 92.81,28.69 arc(93,29.14) 93.45,29.33 100.08,29.33 101.47,30.72 101.47,48.76 102.11,49.39 132.21,49.39 133.47,50.65 U4.2
O5+: length 30
  Top Layer w0.381: R42.2 95.89,28.31 96.14,28.56 101.22,28.56 102.49,29.83 102.49,45.46 102.87,45.84 107.19,45.84 107.7,46.34 107.7,47.13 U5.4
O5-: length 29.6
  Top Layer w0.381: R38.2 102.73,27.67 103.51,28.44 103.51,29.54 arc(103.69,29.99) 104.14,30.17 105.41,30.17 arc(106.05,30.81) 105.41,31.44 104.14,31.44 arc(103.51,32.08) 104.14,32.71 105.41,32.71 arc(106.05,33.35) 105.41,33.98 104.14,33.98 arc(103.51,34.62) 104.14,35.25 105.41,35.25 arc(106.05,35.89) 105.41,36.52 104.14,36.52 arc(103.69,36.71) 103.51,37.16 103.51,40.02 U5.2
O6+: length 26
  Top Layer w0.381: R43.2 110.36,45.07 111.13,45.84 117.35,45.84 117.77,46.25 U6.4
O6-: length 25.9
  Top Layer w0.381: U6.2 113.41,39.99 112.65,39.99 112.14,39.49 112.14,38.26 arc(112.33,37.81) 112.78,37.63 114.17,37.63 arc(114.81,36.99) 114.17,36.36 112.78,36.36 arc(112.14,35.72) 112.78,35.09 114.17,35.09 arc(114.81,34.45) 114.17,33.82 112.78,33.82 arc(112.14,33.18) 112.78,32.55 114.17,32.55 arc(114.81,31.91) 114.17,31.28 112.78,31.28 arc(112.33,31.09) 112.14,30.64 R39.2
O7+: length 27.2
  Top Layer w0.381: U7.4 127.77,46.22 127.13,45.58 123.06,45.58 122.3,44.82 122.3,28.31 122.81,27.8 125.72,27.8 R44.2
O7-: length 24.7
  Top Layer w0.381: R40.2 127.51,28.69 127.25,28.95 124.08,28.95 123.47,29.56 123.47,32.22 arc(123.65,32.67) 124.1,32.85 125.6,32.85 arc(126.24,33.49) 125.6,34.12 124.1,34.12 arc(123.47,34.76) 124.1,35.39 125.6,35.39 arc(126.24,36.03) 125.6,36.66 124.1,36.66 arc(123.65,36.85) 123.47,37.3 U7.2
O8+: length 30.9
  Top Layer w0.381: U8.4 137.8,47.18 137.8,46.22 137.16,45.58 133.1,45.58 132.46,44.95 132.46,28.44 133.22,27.68 R45.2
O8-: length 29.3
  Top Layer w0.381: R41.2 141.48,28.18 140.97,28.69 133.99,28.69 133.47,29.21 133.47,32.64 arc(133.65,33.09) 134.1,33.27 135.76,33.27 arc(136.4,33.91) 135.76,34.54 134.1,34.54 arc(133.47,35.18) 134.1,35.81 135.76,35.81 arc(136.4,36.45) 135.76,37.08 134.1,37.08 arc(133.65,37.27) 133.47,37.72 U8.2
$1N532: length 8.9
  Top Layer w0.635: U9.6 79.43,60.76 80.19,60.01 R4.2 80.19,53.89 U12.1
$1N533: length 8
  Top Layer w0.635: R4.1 81.7,57.68 82.24,58.22 U9.1 85.28,58.22 85.73,57.77 85.73,56 R1.1
$1N783: length 8.9
  Top Layer w0.635: U18.1 34.16,56 R10.2 33.91,56.26 33.91,60.31 33.46,60.76 32.08,60.76
$1N784: length 8.2
  Top Layer w0.635: R7.1 40,55.88 40,57.52 39.37,58.16 37.85,58.16 ; U15.1 37.56,58.16 35.81,58.16 35.42,57.77 R10.1
$1N1034: length 9.1
  Top Layer w0.635: U22.6 64.39,47.36 64.77,46.98 64.77,42.8 R15.2 64.91,40.24 U23.1
$1N1035: length 8.2
  Top Layer w0.635: R13.1 70.87,42.67 70.87,44.44 70.49,44.82 U22.1 67.05,44.82 66.41,44.18 R15.1
$1N1285: length 9.1
  Top Layer w0.635: U25.1 80.53,40.13 R18.2 80.53,46.72 79.88,47.36 U24.6
$1N1286: length 8.5
  Top Layer w0.635: R17.1 86.36,42.54 86.36,44.44 85.98,44.82 U24.1 ; R18.1 82.03,44.43 82.42,44.82 83.85,44.82
$1N1536: length 8.4
  Top Layer w0.635: R5.2 64.64,54.22 U13.1 ; U10.6 64.07,60.76 64.64,60.19 64.64,56.3
$1N1537: length 7.8
  Top Layer w0.635: R5.1 66.15,57.76 66.55,58.16 68.06,58.16 U10.1 69.91,58.22 70.23,57.9 70.23,56.13 R2.1
$1N1787: length 8.8
  Top Layer w0.635: 33.53,42.8 33.53,46.98 33.15,47.36 31.71,47.36 ; 33.53,42.8 R11.2 ; 33.53,42.8 U19.1
$1N1788: length 8.2
  Top Layer w0.635: R11.1 35.04,44.05 35.81,44.82 U16.1 38.99,44.82 39.5,44.31 39.5,42.42 R8.1
$1N2038: length 8.6
  Top Layer w0.635: U11.6 48.57,60.76 49.02,60.31 49.02,56.38 R6.2 49.01,53.6 U14.1
$1N2039: length 8.1
  Top Layer w0.635: R3.1 54.86,55.88 54.86,57.65 54.29,58.22 U11.1 51.12,58.22 50.51,57.61 R6.1
$1N2289: length 8.9
  Top Layer w0.635: U17.6 48.64,47.36 49.15,46.85 49.15,42.8 R12.2 49.16,40.24 U20.1
$1N2290: length 8
  Top Layer w0.635: R12.1 50.66,44.3 51.05,44.69 52.66,44.69 U17.1 54.23,44.82 54.74,44.31 54.74,42.54 R9.1
$1N3001: length 3.9
  Top Layer w0.254: U21.5 13.33,52.82 13.08,53.08 13.08,55.11 13.33,55.36 C13.1
$1N3002: length 7.1
  Top Layer w0.254: 13.83,53.47 13.83,54.21 v2(13.84,54.22)
  Bottom Layer w0.254: v2(13.84,54.22) 12.95,54.22 12.7,53.96 v2(12.7,48.88)
$2N762: length 4.3
  Top Layer w0.254: U26.5 12.22,12.53 11.94,12.82 11.94,14.85 12.19,15.1 C26.1
$2N763: length 7.2
  Top Layer w0.254: v2(12.83,13.96) 12.87,13.92 U26.4
  Bottom Layer w0.254: v2(11.81,8.37) 11.81,13.71 12.06,13.96 v2(12.83,13.96)
$2N769: length 6.6
  Top Layer w0.635: C25.2 19.81,20.44 19.3,19.93 15.37,19.93 15.11,20.18 15.11,20.84 15.16,20.88
$2N770: length 2
  Top Layer w0.635: 17.86,22.78 19.69,22.78 C25.1
$2N774: length 14
  Top Layer w0.254: R21.1 6.23,21.46 6.6,21.83 v2(7.75,21.83)
  Bottom Layer w0.254: v2(7.75,21.83) v2(17.86,21.83)
$2N1271: length 3.7
  Top Layer w0.508: U29.8 40.51,18.02 40.9,18.41 R22.1
$2N1273: length 3.6
  Top Layer w0.508: U29.1 40.51,20.44 41.03,19.92 R22.2
$2N1275: length 4.2
  Top Layer w0.635: R30.1 37.91,25.86 C43.1 37.91,22 U29.3
$2N1276: length 4.2
  Top Layer w0.635: R26.1 39.5,24.31 C43.2 39.24,24.05 U29.2
$2N1798: length 3.9
  Top Layer w0.508: R23.1 55.25,18.41 54.99,18.15 U30.8
$2N1800: length 3.7
  Top Layer w0.508: R23.2 55.63,19.92 54.99,20.56 U30.1
$2N1802: length 4.1
  Top Layer w0.635: U30.3 52.45,24.06 C44.1 52.51,25.72 R31.1
$2N1803: length 4.2
  Top Layer w0.635: R27.1 53.91,25.59 C44.2 53.72,23.93 U30.2
$2N2223: length 4.1
  Top Layer w0.508: U31.8 70.1,18.15 70.54,18.58 R24.1
$2N2225: length 4.1
  Top Layer w0.508: R24.2 72.38,20.06 70.48,20.06 70.1,20.44 U31.1
$2N2227: length 4.6
  Top Layer w0.635: R32.1 67.5,26.22 C45.1 67.56,24.56 U31.3
$2N2228: length 4.6
  Top Layer w0.635: R28.1 69.06,24.79 C45.2 68.83,24.56 U31.2
$2N2648: length 3.7
  Top Layer w0.508: R25.1 84.72,18.54 84.3,18.12 U32.8
$2N2650: length 3.8
  Top Layer w0.508: R25.2 86.22,20.06 84.71,20.06 84.3,20.47 U32.1
$2N2652: length 4.1
  Top Layer w0.635: R33.1 81.72,25.97 C46.1 81.76,24.34 U32.3
$2N2653: length 4.1
  Top Layer w0.635: R29.1 83.12,26.1 C46.2 83.12,22.21 U32.2
$2N3073: length 3.6
  Top Layer w0.508: R34.1 99.07,18.29 98.81,18.02 U33.8
$2N3075: length 3.9
  Top Layer w0.508: R34.2 99.45,19.79 98.81,20.44 U33.1
$2N3077: length 4.3
  Top Layer w0.635: R42.1 96.2,25.84 C63.1 96.27,24.18 U33.3
$2N3078: length 4.2
  Top Layer w0.635: R38.1 97.6,25.97 C63.2 97.54,24.18 U33.2
$2N3498: length 3.7
  Top Layer w0.508: U34.8 113.28,16.52 113.28,18.15 113.55,18.41 R35.1
$2N3500: length 3.7
  Top Layer w0.508: U34.1 113.16,20.31 113.54,19.93 115.05,19.93 R35.2
$2N3502: length 4.6
  Top Layer w0.635: U34.3 110.62,24.45 C64.1 110.51,26.27 R43.1
$2N3503: length 4.6
  Top Layer w0.635: U34.2 111.89,24.53 C64.2 111.91,26.19 R39.1
$2N3923: length 3.6
  Top Layer w0.508: R36.1 128.79,18.16 128.52,17.9 U35.8
$2N3925: length 3.7
  Top Layer w0.508: U35.1 128.52,20.31 129.17,19.67 R36.2
$2N3927: length 4.6
  Top Layer w0.635: R44.1 125.88,26.14 C65.1 125.98,24.32 125.98,21.81
$2N3928: length 4.6
  Top Layer w0.635: U35.2 127.25,24.4 C65.2 127.28,26.06 R40.1
$2N4348: length 3.8
  Top Layer w0.508: R37.1 142.88,18.41 142.62,18.15 142.62,16.36 U36.8
$2N4350: length 3.5
  Top Layer w0.508: R37.2 144.39,19.93 143,19.93 142.53,20.4 U36.1
$2N4352: length 4.5
  Top Layer w0.635: U36.3 139.99,24.15 C66.1 139.89,25.97 R45.1
$2N4353: length 4.4
  Top Layer w0.635: R41.1 141.48,24.44 C66.2 141.26,24.21 U36.2

## Copper pours and planes (outline as drawn; the poured copper is in the pictures)
5V on Top Layer: 61.07,16.98 63.36,16.98 63.36,13.42 61.07,13.42
5V on Top Layer: 89.92,17.01 92.2,17.01 92.2,13.45 89.92,13.45
5V on Top Layer: 45.97,16.88 48.26,16.88 48.26,13.32 45.97,13.32
5V on Top Layer: 31.21,17.15 33.5,17.15 33.5,13.59 31.21,13.59
5V on Top Layer: 119.63,16.63 121.92,16.63 121.92,13.07 119.63,13.07
5V on Top Layer: 133.86,16.37 136.14,16.37 136.14,12.82 133.86,12.82
5V on Top Layer: 75.66,16.74 77.95,16.74 77.95,13.19 75.66,13.19
5V on Top Layer: 15.88,13.83 19.81,13.83 19.81,11.55 15.88,11.55
5V on Top Layer: 104.39,16.75 106.68,16.75 106.68,13.2 104.39,13.2
5V on Bottom Layer: 31.21,17.15 33.24,17.15 33.24,13.47 31.21,13.47
5V on Bottom Layer: 15.88,13.83 19.81,13.83 19.81,11.55 15.88,11.55
5V on Bottom Layer: 133.86,16.37 135.89,16.37 135.89,12.82 133.86,12.82
5V on Bottom Layer: 61.07,16.98 62.85,16.98 62.85,13.42 61.07,13.42
5V on Bottom Layer: 104.39,16.75 106.32,16.75 106.32,13.19 104.39,13.19
5V on Bottom Layer: 75.66,16.74 77.43,16.74 77.43,13.19 75.66,13.19
5V on Bottom Layer: 89.92,17.01 91.69,17.01 91.69,13.47 89.92,13.47
5V on Bottom Layer: 119.63,16.63 121.67,16.63 121.67,13.07 119.63,13.07
5V on Bottom Layer: 45.97,16.88 47.61,16.88 47.61,13.35 45.97,13.35
-5V on Top Layer: 119.51,24.82 122.81,24.82 122.81,21.9 119.51,21.9
-5V on Top Layer: 75.43,24.85 78.73,24.85 78.73,21.93 75.43,21.93
-5V on Top Layer: 31.37,24.88 34.67,24.88 34.67,22.24 31.37,22.24
-5V on Top Layer: 104.52,24.69 107.82,24.69 107.82,21.77 104.52,21.77
-5V on Top Layer: 46.23,24.63 49.53,24.63 49.53,21.71 46.23,21.71
-5V on Top Layer: 61.34,24.69 64.64,24.69 64.64,21.77 61.34,21.77
-5V on Top Layer: 12.7,26.53 15.67,26.53 15.67,22.68 12.7,22.68
-5V on Top Layer: 89.79,24.56 93.09,24.56 93.09,21.64 89.79,21.64
-5V on Top Layer: 133.86,24.82 137.16,24.82 137.16,21.9 133.86,21.9
-5V on Bottom Layer: 75.31,24.88 78.73,24.88 78.73,23.16 75.31,23.16
-5V on Bottom Layer: 46.23,24.63 49.55,24.63 49.55,22.84 46.23,22.84
-5V on Bottom Layer: 61.34,24.69 64.64,24.69 64.64,22.97 61.34,22.97
-5V on Bottom Layer: 133.86,24.88 137.16,24.88 137.16,23.01 133.86,23.01
-5V on Bottom Layer: 31.37,24.88 34.67,24.88 34.67,23.15 31.37,23.15
-5V on Bottom Layer: 12.7,26.53 15.67,26.53 15.67,23.03 12.7,23.03
-5V on Bottom Layer: 119.51,24.88 122.81,24.88 122.81,23.12 119.51,23.12
-5V on Bottom Layer: 104.52,24.69 107.82,24.69 107.82,22.85 104.52,22.85
-5V on Bottom Layer: 89.79,24.56 93.24,24.56 93.24,22.72 89.79,22.72
AGND on Top Layer: 25.65,75.05 158.5,75.05 158.5,-1.53 25.65,-1.53
AGND on Bottom Layer: 25.65,75.11 161.54,75.11 161.54,-1.47 25.65,-1.47
PGND on Top Layer: -2.03,72.89 22.99,72.89 22.99,-1.79 -2.03,-1.79
PGND on Bottom Layer: -10.32,72.63 22.95,72.63 22.95,-2.04 -10.32,-2.04
VCC234 on Top Layer: 69.64,63.92 73.08,63.92 73.08,61.7 69.64,61.7
VCC234 on Top Layer: 85.56,50.15 89,50.15 89,47.93 85.56,47.93
VCC234 on Top Layer: 38.67,50.37 42.11,50.37 42.11,48.16 38.67,48.16
VCC234 on Top Layer: 17.06,57.99 20.32,57.99 20.32,51.93 17.06,51.93
VCC234 on Top Layer: 85.02,63.96 88.46,63.96 88.46,61.75 85.02,61.75
VCC234 on Top Layer: 69.65,50.37 73.09,50.37 73.09,48.16 69.65,48.16
VCC234 on Top Layer: 54.29,50.37 57.73,50.37 57.73,48.16 54.29,48.16
VCC234 on Top Layer: 38.99,64 42.43,64 42.43,61.78 38.99,61.78
VCC234 on Top Layer: 54.4,63.83 57.84,63.83 57.84,61.61 54.4,61.61
VCC234 on Bottom Layer: 69.65,50.37 73.09,50.37 73.09,49.27 69.65,49.27
VCC234 on Bottom Layer: 38.67,50.37 42.11,50.37 42.11,49.27 38.67,49.27
VCC234 on Bottom Layer: 17.06,56.9 20.32,56.9 20.32,53.22 17.06,53.22
VCC234 on Bottom Layer: 69.6,64 73.08,64 73.08,62.81 69.6,62.81
VCC234 on Bottom Layer: 54.36,63.87 57.84,63.87 57.84,62.76 54.36,62.76
VCC234 on Bottom Layer: 54.23,50.41 57.73,50.41 57.73,49.27 54.23,49.27
VCC234 on Bottom Layer: 85.56,50.15 89,50.15 89,49.04 85.56,49.04
VCC234 on Bottom Layer: 85.02,63.96 88.46,63.96 88.46,62.7 85.02,62.7
VCC234 on Bottom Layer: 38.99,64 42.43,64 42.43,62.89 38.99,62.89
$1N3002 on Top Layer: 11.35,49.54 14.05,49.54 14.05,48.22 11.35,48.22
$1N3002 on Bottom Layer: 11.35,49.54 14.05,49.54 14.05,48.22 11.35,48.22
$2N763 on Top Layer: 10.33,9.03 13.29,9.03 13.29,7.71 10.33,7.71
$2N763 on Bottom Layer: 10.33,9.03 13.29,9.03 13.29,7.71 10.33,7.71

Small or netless copper shapes (teardrops, artwork), in the pictures only: 236 on Top Layer, 19 on Bottom Layer
